# Altium schematic sheet micro-ATMEGA64M1.SchDoc: ATMega32M1
size A4; DrawnBy: Dylan Vogel; Organization: UTAT SS; Revision: 1.1
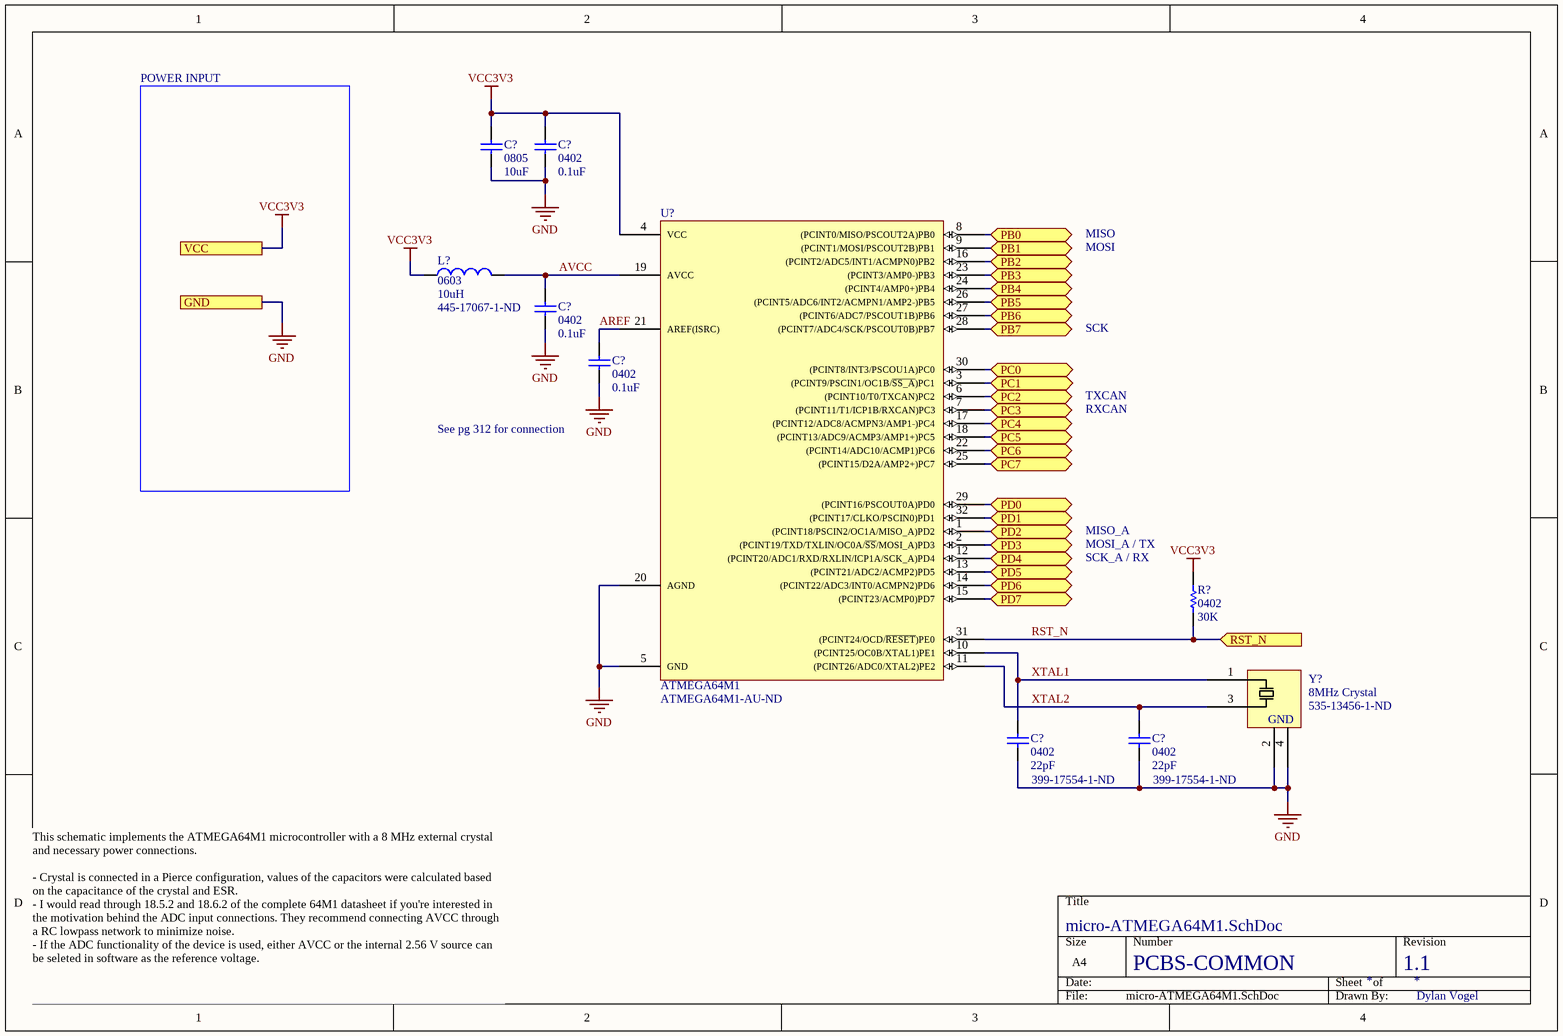
[diagram p0: micro-ATMEGA64M1.SchDoc]

## Parts
(Parts that share a designator on the sheet are numbered #1, #2 ... from top to bottom, then left to right.)
C?#1  0805  value 10uF  [CAP0805R]
C?#2  0402  value 0.1uF  [CAP0402R]
C?#3  0402  value 0.1uF  [CAP0402R]
C?#4  0402  value 0.1uF  [CAP0402R]
C?#5  0402  value 22pF  Supplier Part Number 1: 399-17554-1-ND  [CAP0402R]
C?#6  0402  value 22pF  Supplier Part Number 1: 399-17554-1-ND  [CAP0402R]
L?  0603  value 10uH  Supplier Part Number 1: 445-17067-1-ND  [RES0603R]
R?  0402  value 30K  [RES0402R]
U?  ATMEGA64M1  Supplier Part Number 1: ATMEGA64M1-AU-ND  [QFP80P900X900X120-32]
Y?  8MHz Crystal  Supplier Part Number 1: 535-13456-1-ND  [OSCSC500X320X110-4N]

## Ports
GND, PB0 (bidir), PB1 (bidir), PB2 (bidir), PB3 (bidir), PB4 (bidir), PB5 (bidir), PB6 (bidir), PB7 (bidir), PC0 (bidir), PC1 (bidir), PC2 (bidir), PC3 (bidir), PC4 (bidir), PC5 (bidir), PC6 (bidir), PC7 (bidir), PD0 (bidir), PD1 (bidir), PD2 (bidir), PD3 (bidir), PD4 (bidir), PD5 (bidir), PD6 (bidir), PD7 (bidir), RST_N (in), VCC

## Nets
GND: C?#1.1 C?#2.1 C?#3.1 C?#4.1 C?#5.1 C?#6.1 U?.5(GND) U?.20(AGND) Y?.2 Y?.4 ; port GND
VCC3V3: C?#1.2 C?#2.2 L?.1 R?.2 U?.4(VCC) ; port VCC
AREF: C?#4.2 U?.21(AREF(ISRC))
AVCC: C?#3.2 L?.2 U?.19(AVCC)
PB0: U?.8((PCINT0/MISO/PSCOUT2A)PB0) ; port PB0
PB1: U?.9((PCINT1/MOSI/PSCOUT2B)PB1) ; port PB1
PB2: U?.16((PCINT2/ADC5/INT1/ACMPN0)PB2) ; port PB2
PB3: U?.23((PCINT3/AMP0-)PB3) ; port PB3
PB4: U?.24((PCINT4/AMP0+)PB4) ; port PB4
PB5: U?.26((PCINT5/ADC6/INT2/ACMPN1/AMP2-)PB5) ; port PB5
PB6: U?.27((PCINT6/ADC7/PSCOUT1B)PB6) ; port PB6
PB7: U?.28((PCINT7/ADC4/SCK/PSCOUT0B)PB7) ; port PB7
PC0: U?.30((PCINT8/INT3/PSCOU1A)PC0) ; port PC0
PC1: U?.3((PCINT9/PSCIN1/OC1B/~{SS_A})PC1) ; port PC1
PC2: U?.6((PCINT10/T0/TXCAN)PC2) ; port PC2
PC3: U?.7((PCINT11/T1/ICP1B/RXCAN)PC3) ; port PC3
PC4: U?.17((PCINT12/ADC8/ACMPN3/AMP1-)PC4) ; port PC4
PC5: U?.18((PCINT13/ADC9/ACMP3/AMP1+)PC5) ; port PC5
PC6: U?.22((PCINT14/ADC10/ACMP1)PC6) ; port PC6
PC7: U?.25((PCINT15/D2A/AMP2+)PC7) ; port PC7
PD0: U?.29((PCINT16/PSCOUT0A)PD0) ; port PD0
PD1: U?.32((PCINT17/CLKO/PSCIN0)PD1) ; port PD1
PD2: U?.1((PCINT18/PSCIN2/OC1A/MISO_A)PD2) ; port PD2
PD3: U?.2((PCINT19/TXD/TXLIN/OC0A/~{SS}/MOSI_A)PD3) ; port PD3
PD4: U?.12((PCINT20/ADC1/RXD/RXLIN/ICP1A/SCK_A)PD4) ; port PD4
PD5: U?.13((PCINT21/ADC2/ACMP2)PD5) ; port PD5
PD6: U?.14((PCINT22/ADC3/INT0/ACMPN2)PD6) ; port PD6
PD7: U?.15((PCINT23/ACMP0)PD7) ; port PD7
RST_N: R?.1 U?.31((PCINT24/OCD/~{RESET})PE0) ; port RST_N
XTAL1: C?#5.2 U?.10((PCINT25/OC0B/XTAL1)PE1) Y?.1(IN)
XTAL2: C?#6.2 U?.11((PCINT26/ADC0/XTAL2)PE2) Y?.3(IN)

## Notes on the sheet
- POWER INPUT
- MOSI
- MISO
- SCK
- See pg 312 for connection
- TXCAN
- RXCAN
- (near R?) MOSI_A / TX
- MISO_A
- (near R?) SCK_A / RX
- PCBS-COMMON
- This schematic implements the ATMEGA64M1 microcontroller with a 8 MHz external crystal and necessary power connections.
  - Crystal is connected in a Pierce configuration, values of the capacitors were calculated based on the capacitance of the crystal and ESR.
  - I would read through 18.5.2 and 18.6.2 of the complete 64M1 datasheet if you're interested in the motivation behind the ADC input connections. They recommend connecting AVCC through a RC lowpass network to minimize noise.
  - If the ADC functionality of the device is used, either AVCC or the internal 2.56 V source can be seleted in software as the reference voltage.
- (in symbol AMB3B-8MHz) GND

## Library data of the parts
C?#1 = CAP0805: 0805 capacitor; Manufacturer: Murata; Manufacturer Part Number: GCM21BR70J106KE22K; Description: Cap Ceramic 10uF 6.3V X7R 10% SMD 0805 125C Embossed T/R; Tolerance: 10%; Dielectric: X7R; Voltage Rating (DC): 6.3V; Supplier 1: Digi-Key; Supplier Part Number 1: 490-14361-1-ND; Stock 1: 214938; Pricing 1: 1=0.42, 10=0.29, 100=0.1742, 500=0.13064, 1000=0.11031, 2500=0.10451, 5000=0.0987 (USD); Case/Package: 0805; Min Operating Temperature: -55°C; Max Operating Temperature: 125°C; Capacitance: 10uF; Packaging: Tape and Reel; Length: 2mm; Depth: 1.25mm; Lead Free: Lead Free
C?#2-C?#4 = CAP0402: 0402 capacitor; Manufacturer: Taiyo Yuden; Manufacturer Part Number: EMK105B7104KVHF; Description: Multilayer Ceramic Capacitors MLCC - SMD/SMT 0.1uF 16V X7R +/-10% 0402 AEC-Q200; Voltage Rating: 16V; Capacitance: 100nF; Tolerance: 10%; Dielectric: X7R; Supplier 1: Digi-Key; Supplier Part Number 1: 587-3807-1-ND; Stock 1: 18196; Pricing 1: 1=0.1, 10=0.057, 100=0.0254, 500=0.01812, 1000=0.01423, 2500=0.01294, 5000=0.0119 (USD); Mount: Surface Mount; Case/Package: 0402; Weight: 2.3E-05oz; Case Code (Metric): 1005; Case Code (Imperial): 0402; Min Operating Temperature: -55°C; Max Operating Temperature: 125°C; Package Quantity: 10000; Packaging: Tape and Reel; Termination: SMD/SMT; Voltage Rating (DC): 16V; Length: 0.039inch; Height: 0.5mm; Width: 0.02inch; Thickness: 0.022inch; Ratings: AEC-Q200; Lead Free: Lead Free; Halogen Free: Halogen Free
C?#5 C?#6 = CAP0402: 0402 capacitor; Manufacturer: KEMET; Manufacturer Part Number: C0402C220K4RAC7867; Description: CAP CER SMD 0402 22PF 10% X7R 16; Tolerance: 10%; Voltage Rating: 16V; Supplier 1: Digi-Key; Stock 1: 68765; Pricing 1: 1=0.19, 10=0.132, 100=0.062, 500=0.0435, 1000=0.03601, 2500=0.03351, 5000=0.03066 (USD); Mount: Surface Mount; Case/Package: 0402; Case Code (Imperial): 0402; Case Code (Metric): 1005; Min Operating Temperature: -55°C; Max Operating Temperature: 125°C; Packaging: Tape and Reel; Capacitance: 22pF
L? = Inductor: Manufacturer: TDK; Manufacturer Part Number: MLZ1608N100LTD25; Code_IEC: 1005; Core Material: Ferrite; Saturation Current: 60mA; Shielding: Shielded; Tolerance: 20%; Current Rating: 300mA; DC Resistance (DCR): 780mR; Test Frequency: 2MHz; Published: 8-Jun-2000; LatestRevisionDate: 29-May-2009; LatestRevisionNote: IPC-7351 Footprint Added.; PackageReference: 0402-A; Publisher: Altium Limited; PackageDescription: Chip Inductor; Code_JEITA: 0402; Supplier 1: Digi-Key; Stock 1: 11876; Pricing 1: 1=0.22, 10=0.202, 100=0.1346, 500=0.11212, 1000=0.09419 (USD); Mount: Surface Mount; Case/Package: 0603; Weight: 0.000141oz; Case Code (Metric): 1608; Case Code (Imperial): 0603; Min Operating Temperature: -55°C; Max Operating Temperature: 125°C; Package Quantity: 4000; Packaging: Tape and Reel; Inductance: 10uH; Termination: SMD/SMT; Max DC Current: 300mA; Length: 0.063inch; Height: 0.8mm; Width: 0.8mm; Height - Seated (Max): 0.037inch; Ratings: AEC-Q200; Lead Free: Lead Free
R? = RES0402: 0402 resistor; Manufacturer: Yageo; Manufacturer Part Number: AC0402FR-0730KL; Description: Thick Film Resistors - SMD 1/16W 30K ohm 1% AEC-Q200; Tolerance: 1%; Power Rating: 62.5mW; Resistance: 30kR; Voltage Rating: 50V; Temperature Coefficient: 100ppm/°C; Max Power Dissipation: 63mW; Supplier 1: Digi-Key; Supplier Part Number 1: YAG3474CT-ND; Stock 1: 756314; Pricing 1: 1=0.1, 10=0.022, 100=0.009, 1000=0.00403, 2500=0.0035, 5000=0.00289 (USD); Case/Package: 0402; Weight: 2.3E-05oz; Case Code (Imperial): 0402; Case Code (Metric): 1005; Min Operating Temperature: -55°C; Max Operating Temperature: 155°C; Packaging: Tape and Reel; Composition: Thick Film; Termination: SMD/SMT; Number of Terminations: 2; Features: Moisture Resistant,Automotive AEC-Q200; Length: 0.039inch; Height: 0.015inch; Width: 0.5mm; Lead Free: Lead Free
U? = ATMEGA64M1_QFP: Atmel 8-bit AVR microcontroller.; Supplier 1: Digi-Key
Y? = AMB3B-8MHz: 8MHz Abracom 4-pin crystal.; Supplier 1: Digi-Key